# EAGLE schematic wheatstone bridge (EAGLE 9.5.0)
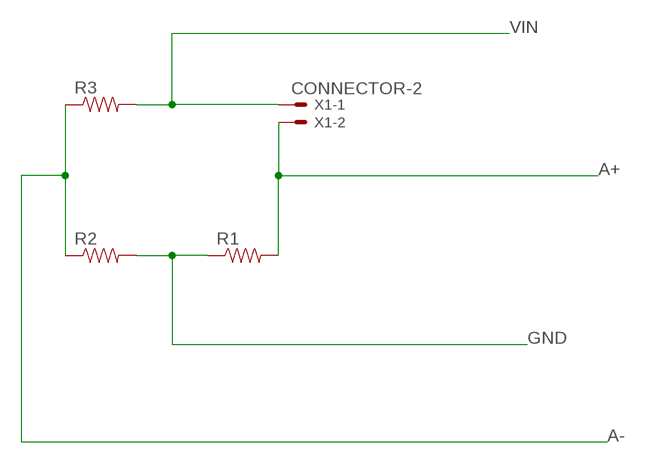
[diagram p0: schematic, sheet 1]

## Parts
R1  RESISTORAXIAL-0.3  [AXIAL-0.3]
R2  RESISTORAXIAL-0.3  [AXIAL-0.3]
R3  RESISTORAXIAL-0.3  [AXIAL-0.3]
X1  CONNECTOR-2  [MINIFIT_5566-2]

## Nets
A+: R1.P$2 X1.2
A-: R2.P$1 R3.P$1
GND: R1.P$1 R2.P$2
VIN: R3.P$2 X1.1

## Library data of the parts
R1-R3 = HyTechDevices:RESISTOR: Resistor Basic schematic elements and footprints for 0603, 1206, and PTH resistors.
X1 = HyTechDevices:CONNECTOR-2: Mini-Fit Junior connector 2 pole Source: http://www.molex.com; OC_FARNELL: 1822072; OC_NEWARK: unknown